# EAGLE schematic Arduino Shield V4 - Small - 7805 - REG - 25-11-2023 (EAGLE 9.1.3)
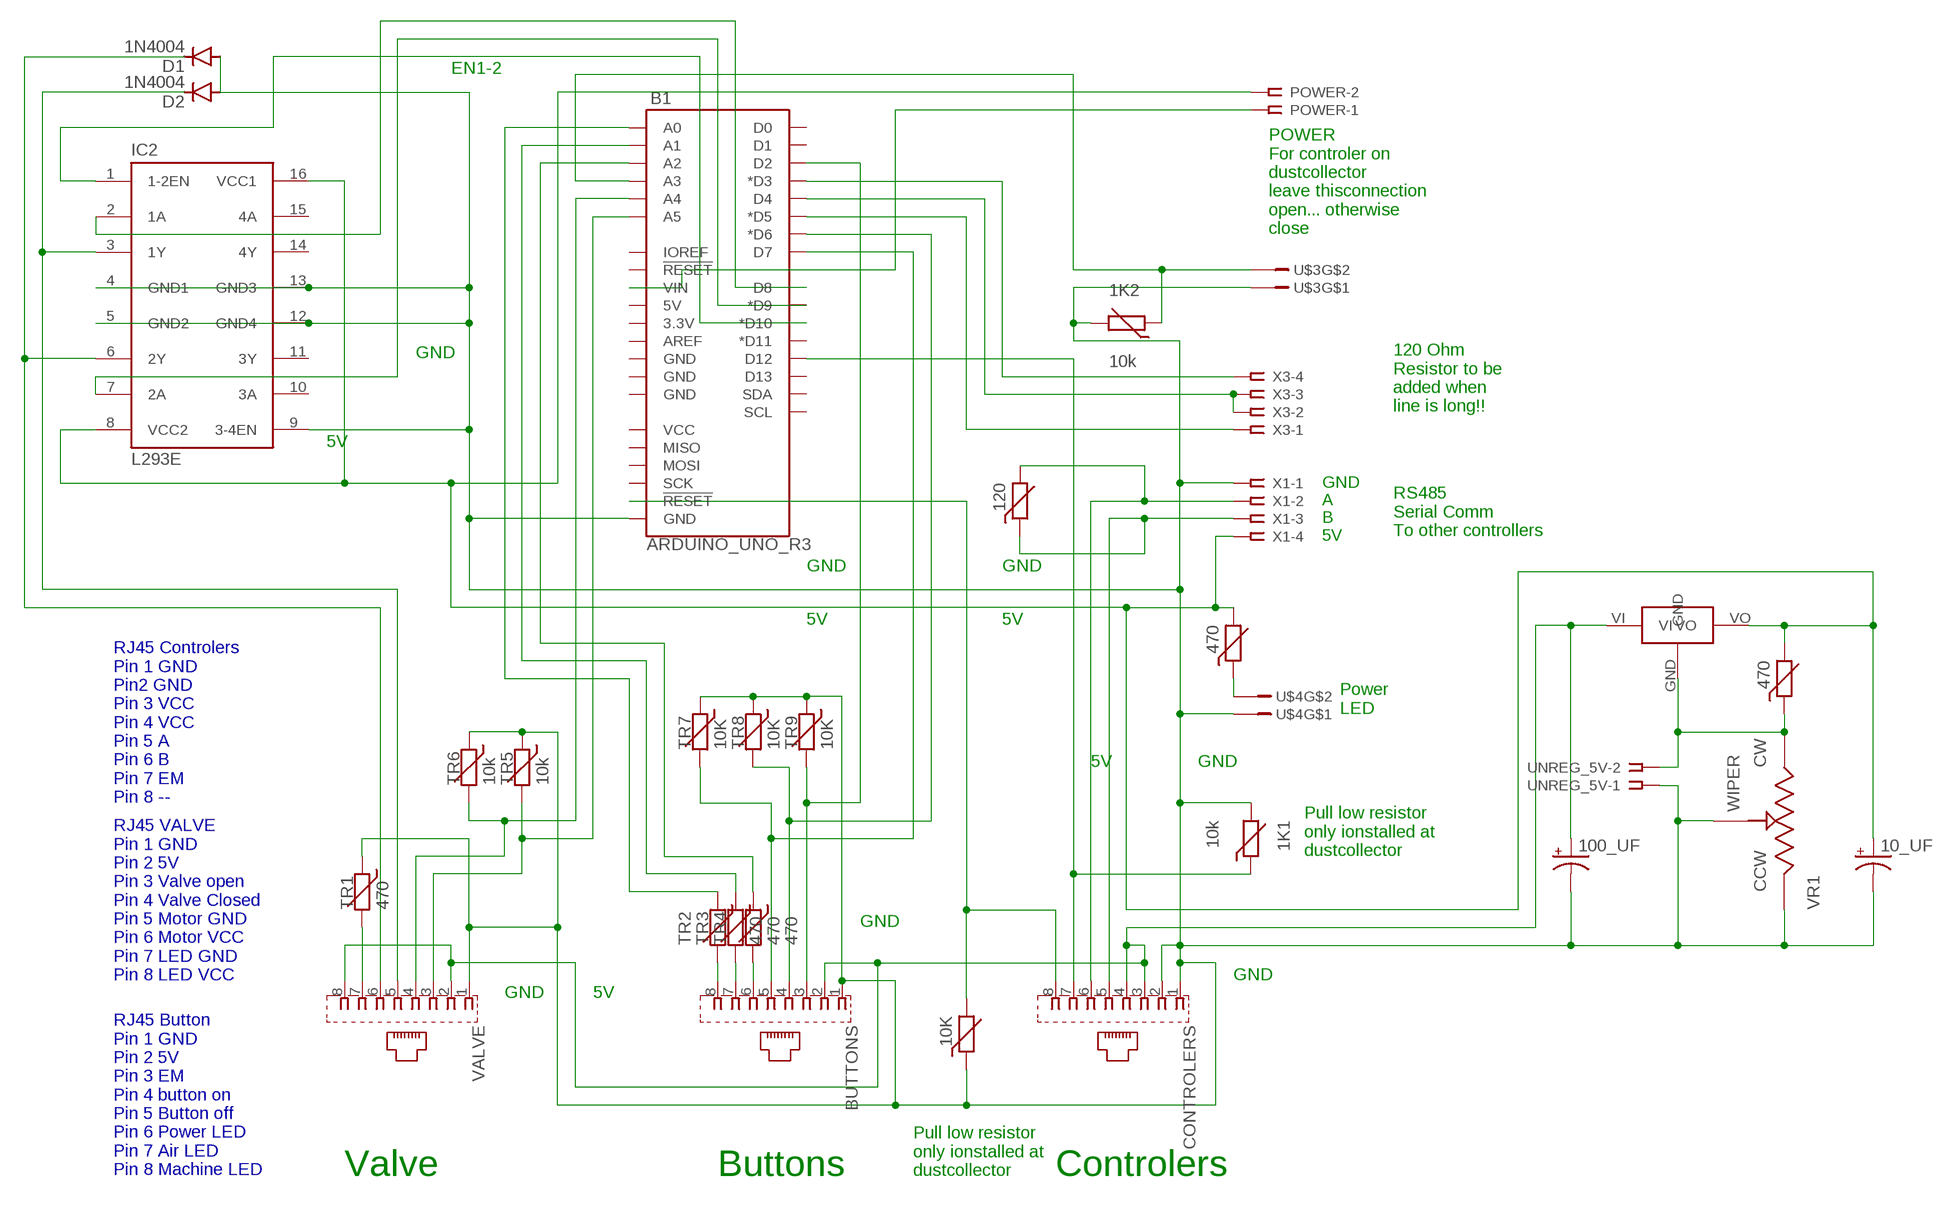
[diagram p0: schematic, sheet 1]

## Parts
1K  470  THERMISTOR_R-7,5  [R-7,5]
1K1  10k  THERMISTOR_R-7,5  [R-7,5]
1K2  10k  THERMISTOR_R-7,5  [R-7,5]
1K3  120  THERMISTOR_R-7,5  [R-7,5]
1K4  470  THERMISTOR_R-7,5  [R-7,5]
10_UF  CPOL-USE2,5-6E  [E2,5-6E]
10K  10K  THERMISTOR_R-7,5  [R-7,5]
100_UF  CPOL-USE2,5-6E  [E2,5-6E]
B1  ARDUINO_UNO_R3  [ARDUINO_R3]
BUTTONS  GLX-S-88MRJ45  [GLX-S-88M]
CONTROLERS  GLX-S-88MRJ45  [GLX-S-88M]
D1  1N4004  [DO41-10]
D2  1N4004  [DO41-10]
IC2  L293E  [DIL16]
POWER  SSW-102-02-G-S  [SSW-102-02-G-S]
TR1  470  THERMISTOR_R-7,5  [R-7,5]
TR2  470  THERMISTOR_R-7,5  [R-7,5]
TR3  470  THERMISTOR_R-7,5  [R-7,5]
TR4  470  THERMISTOR_R-7,5  [R-7,5]
TR5  10k  THERMISTOR_R-7,5  [R-7,5]
TR6  10k  THERMISTOR_R-7,5  [R-7,5]
TR7  10K  THERMISTOR_R-7,5  [R-7,5]
TR8  10K  THERMISTOR_R-7,5  [R-7,5]
TR9  10K  THERMISTOR_R-7,5  [R-7,5]
U$1  7805-TO220V  [TO220AV]
U$3  JST2  [HDRV2W64P254_1X2_712X508X838B]
U$4  JST2  [HDRV2W64P254_1X2_712X508X838B]
UNREG_5V  SSW-102-02-G-S  [SSW-102-02-G-S]
VALVE  GLX-S-88MRJ45  [GLX-S-88M]
VR1  3296W-1-103LF  [W]
X1  SSW-104-02-G-S  [SSW-104-02-G-S]
X3  SSW-104-02-G-S  [SSW-104-02-G-S]

## Nets
N$1: 10K.2 B1.RESET@2(!RESET!) CONTROLERS.8
N$2: 1K1.1 B1.D12 CONTROLERS.7
N$3: 1K3.2 CONTROLERS.6 X1.2
N$4: 1K3.1 CONTROLERS.5 X1.3
N$5: B1.A4 TR6.2 VALVE.4
N$6: B1.D8 IC2.2(1A)
N$7: B1.D9(*D9) IC2.7(2A)
N$8: D1.C IC2.6(2Y) VALVE.6
N$9: D2.C IC2.3(1Y) VALVE.5
N$10: TR1.2 VALVE.7
N$11: BUTTONS.8 TR2.2
N$12: 1K.1 U$4.2
N$13: 1K2.1 B1.A3 U$3.2
N$14: 1K1.2 1K2.2 10_UF.- 10K.1 100_UF.- B1.GND@1(GND) BUTTONS.1 CONTROLERS.1 CONTROLERS.2 D1.A D2.A IC2.4(GND1) IC2.5(GND2) IC2.9(3-4EN) IC2.12(GND4) IC2.13(GND3) TR1.1 TR5.1 TR6.1 TR7.1 TR8.1 TR9.1 U$3.1 U$4.1 UNREG_5V.1 VALVE.1 VR1.1 VR1.2 X1.1
N$15: B1.A1 TR3.1
N$16: BUTTONS.7 TR3.2
N$17: BUTTONS.6 TR4.2
N$18: B1.A0 TR2.1
N$19: B1.D10(*D10) IC2.1(1-2EN)
N$20: B1.A2 TR4.1
N$21: B1.D7 BUTTONS.5 TR7.2
N$22: B1.D6(*D6) BUTTONS.4 TR8.2
N$23: B1.D2 BUTTONS.3 TR9.2
N$24: B1.D3(*D3) X3.4
N$25: B1.D4 X3.2 X3.3
N$26: B1.D5(*D5) X3.1
N$27: B1.A5 TR5.2 VALVE.3
N$28: 1K4.1 U$1.GND UNREG_5V.2 VR1.3
N$30: B1.VIN POWER.1
N$31: 1K4.2 1K.2 10_UF.+ IC2.8(VCC2) IC2.16(VCC1) POWER.2 U$1.VO X1.4
N$32: 100_UF.+ BUTTONS.2 CONTROLERS.3 CONTROLERS.4 U$1.VI VALVE.2 VALVE.8
Unconnected: B1.3.3V B1.5V B1.AREF B1.D0 B1.D1 B1.D11(*D11) B1.D13 B1.GND@2(GND) B1.GND@3(GND) B1.GND@4(GND) B1.IOREF B1.MISO B1.MOSI B1.RESET@1(!RESET!) B1.SCK B1.SCL B1.SDA B1.VCC IC2.10(3A) IC2.11(3Y) IC2.14(4Y) IC2.15(4A)

## Notes on the sheet
- EN1-2
- POWER
  For controler on
  dustcollector 
  leave thisconnection 
  open... otherwise
  close
- GND
- 120 Ohm
  Resistor to be
  added when
  line is long!!
- 5V
- RS485
  Serial Comm
  To other controllers
- GND
  A
  B
  5V
- GND | GND
- 5V | 5V
- Power
  LED
- 5V | GND
- RJ45 Controlers
  Pin 1 GND
  Pin2 GND
  Pin 3 VCC
  Pin 4 VCC
  Pin 5 A
  Pin 6 B
  Pin 7 EM
  Pin 8 --
- Pull low resistor
  only ionstalled at 
  dustcollector
- GND
- RJ45 VALVE
  Pin 1 GND
  Pin 2 5V
  Pin 3 Valve open
  Pin 4 Valve Closed
  Pin 5 Motor GND
  Pin 6 Motor VCC
  Pin 7 LED GND
  Pin 8 LED VCC
- GND
- GND | 5V
- Valve | Buttons
- Pull low resistor
  only ionstalled at 
  dustcollector
- Controlers
- RJ45 Button
  Pin 1 GND 
  Pin 2 5V 
  Pin 3 EM 
  Pin 4 button on 
  Pin 5 Button off
  Pin 6 Power LED 
  Pin 7 Air LED 
  Pin 8 Machine LED

## Library data of the parts
1K 1K1-1K4 10K TR1-TR9 = discrete:THERMISTOR_: Thermo Resistor
10_UF 100_UF = rcl:CPOL-US: POLARIZED CAPACITOR, American symbol; SPICEPREFIX: C
B1 = SparkFun-Boards:ARDUINO_UNO_R3: Arduino R3 Footprint with SPI header Arduino Uno R3 Compatible Footprint. Matches PCB size of the original board. SparkFun Products: SAMD21 Dev Breakout <https://www.sparkfun.com/products/13672> RedBoard <https://www.sparkfun.com/products/12757> R3 Stackable Headers <https://www.sparkfun.com/products/11417>
BUTTONS CONTROLERS VALVE = con-kyconedited:GLX-S-88M: Mod. Jack, Right Angle, 8 posiotion, 8 contatcs RJ45 Source: GLX-S-88M.pdf; OC_FARNELL: unknown; OC_NEWARK: unknown
D1 D2 = diode:1N4004: DIODE general purpose rectifier, 1 A
IC2 = texas:L293E: TI DEVICE; MF: Arrow Electronics; MPN: L293E; OC_FARNELL: 1467711; OC_NEWARK: 89K0732
POWER UNREG_5V = con-samtecedited:SSW-102-02-G-S: THROUGH-HOLE .025" SQ POST SOCKET Source: Samtec SSW.pdf; MF: Samtec Inc.; MPN: SSW-102-02-G-S; OC_FARNELL: unknown; OC_NEWARK: 11P9351
U$1 = LM7805:7805-TO220V
U$3 U$4 = con-jstedited:JST2
VR1 = Volks73-Bourns:3296?-*: Trim Potentiometer (Pot) Documentation Datasheet <http://www.bourns.com/data/global/pdfs/3296.pdf> Features Multiturn/Cermet/Industrial/Sealed 5 terminal styles Tape and reel packaging Chevron seal design Listed on the QPL for style RJ24 per MIL-R_22097 and RJR24 per High-Rel Mil-R-39035 Mounting hardware available (H-117P) RoHS compliant* version available For trimmer applications/processing guidelines, click here <http://www.bourns.com/data/global/pdfs/ap_proc.pdf>; ADJUSTMENT_TYPE: Tope Adjustment; CATEGORY: Potentiometers, Variable Resistors; DESCRIPTION: TRIMMER 10K OHM 0.5W PC PIN; DOCUMENTATION_LINK: <a href="http://www.bourns.com/data/global/pdfs/3296.pdf">Datasheet</a>; DOCUMENTATION_URL: http://www.bourns.com/data/global/pdfs/3296.pdf; FAMILY: Trimmer Potentiometers; MANUFACTURER: Bourns Inc; MOUNTING_TYPE: Through Hole; NUMBER_OF_TURNS: 25; PART_NUMBER: 3296W-1-103LF; POWER: 0.5W, 1/2W; RESISTANCE: 10k; RESISTIVE_MATERIAL: Cermet; SERIES: Trimpt 3296 - Sealed; SIZE: Rectangular - 0.375" x 0.190" Face x 0.395" H (9.53mm x 4.83mm x 10.03mm); STANDARD_PACKAGE: 50; SUPPLIER_ITEM_LINK: <a href="http://www.digikey.com/product-detail/en/3296W-1-103LF/3296W-103LF-ND/1088045">Details</a>; SUPPLIER_ITEM_NUMBER: 3296W-103LF-ND; SUPPLIER_ITEM_URL: http://www.digikey.com/product-detail/en/3296W-1-103LF/3296W-103LF-ND/1088045; SUPPLIER_LINK: <a href="http://www.digikey.com">Home Page</a>; SUPPLIER_NAME: Digi-Key; SUPPLIER_URL: http://www.digikey.com; TEMPERATURE_COEFFICIENT: 100ppm/C; TERMINATION_STYLE: PC Pin; TOLERANCE: 10%
X1 X3 = con-samtec:SSW-104-02-G-S: THROUGH-HOLE .025" SQ POST SOCKET Source: Samtec SSW.pdf; MF: Samtec Inc.; MPN: SSW-104-02-G-S; OC_FARNELL: unknown; OC_NEWARK: 11P9384